# EAGLE design placa_teste_av (EAGLE 9.0.0)
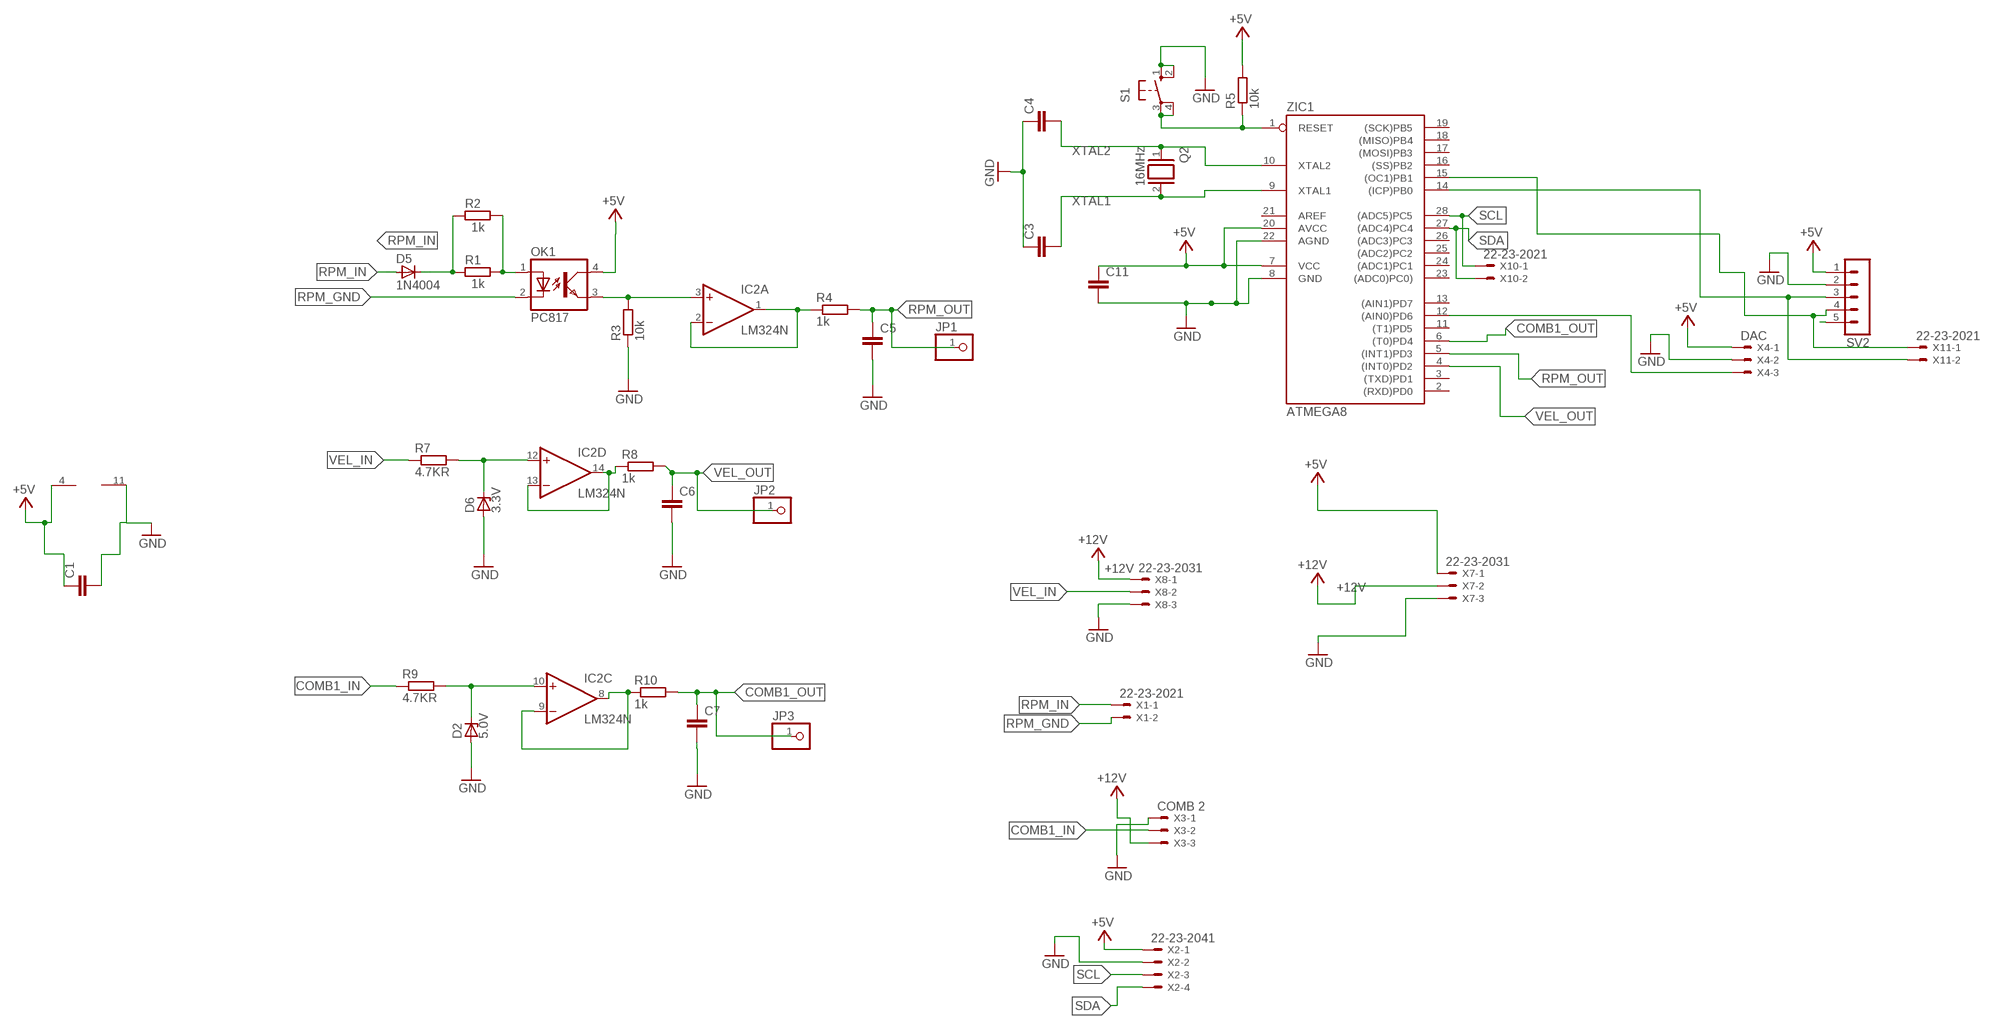
[diagram p0: schematic, sheet 1]

## Parts
C1  C5/2.5  [C5B2.5]
C3  C-EU025-024X044  [C025-024X044]
C4  C-EU025-024X044  [C025-024X044]
C5  C5/2.5  [C5B2.5]
C6  C5/2.5  [C5B2.5]
C7  C5/2.5  [C5B2.5]
C11  C5/2.5  [C5B2.5]
D2  5.0V  ZENER-DIODEDO34-7  [DO34Z7]
D5  1N4004  [DO41-10]
D6  3.3V  ZENER-DIODEDO34-7  [DO34Z7]
IC2  LM324N  [DIL14]
JP1  PINHD-1X1  [1X01]
JP2  PINHD-1X1  [1X01]
JP3  PINHD-1X1  [1X01]
OK1  PC817  [DIL04]
Q2  16MHz  XTAL/S  [QS]
R1  1k  R-EU_0207/7  [0207/7]
R2  1k  R-EU_0207/7  [0207/7]
R3  10k  R-EU_0207/7  [0207/7]
R4  1k  R-EU_0207/7  [0207/7]
R5  10k  R-EU_0207/7  [0207/7]
R7  4.7KR  R-EU_0207/7  [0207/7]
R8  1k  R-EU_0207/7  [0207/7]
R9  4.7KR  R-EU_0207/7  [0207/7]
R10  1k  R-EU_0207/7  [0207/7]
S1  10-XX  [B3F-10XX]
SV2  MA05-1  [MA05-1]
X1  22-23-2021  [22-23-2021]
X2  22-23-2041  [22-23-2041]
X3  COMB 2  22-23-2031  [22-23-2031]
X4  DAC  22-23-2031  [22-23-2031]
X7  22-23-2031  [22-23-2031]
X8  22-23-2031  [22-23-2031]
X10  22-23-2021  [22-23-2021]
X11  22-23-2021  [22-23-2021]
ZIC1  ATMEGA8  AT90S4433P  [DIL28-3]

## Nets
+5V: C1.1 C11.1 IC2.4(P:V+) OK1.4(COL) R5.2 SV2.1 X2.1 X4.1 X7.1 ZIC1.7(VCC) ZIC1.20(AVCC)
+12V: X3.3 X7.2 X8.1
COMB1_IN: R9.1 X3.2
COMB1_OUT: C7.1 JP3.1 R10.2 ZIC1.6((T0)PD4)
GND: C1.2 C3.1 C4.1 C5.2 C6.2 C7.2 C11.2 D2.A D6.A IC2.11(P:V-) R3.1 S1.1(S) S1.2(S1) SV2.2 X2.2 X3.1 X4.2 X7.3 X8.3 ZIC1.8(GND) ZIC1.22(AGND)
IO1: SV2.3 X11.2 ZIC1.14((ICP)PB0)
IO2: SV2.4 X11.1 ZIC1.15((OC1)PB1)
N$1: OK1.1(A) R1.2 R2.2
N$2: D5.C R1.1 R2.1
N$3: SV2.5
N$4: IC2.1(A:OUT) IC2.2(A:-IN) R4.1
N$5: D2.C IC2.10(C:+IN) R9.2
N$7: IC2.3(A:+IN) OK1.3(EMIT) R3.2
N$8: D6.C IC2.12(D:+IN) R7.2
N$9: R5.1 S1.3(P) S1.4(P1) ZIC1.1(RESET)
N$10: X4.3 ZIC1.12((AIN0)PD6)
N$12: IC2.8(C:OUT) IC2.9(C:-IN) R10.1
PA10: IC2.13(D:-IN) IC2.14(D:OUT) R8.1
RPM_GND: OK1.2(C) X1.2
RPM_IN: D5.A X1.1
RPM_OUT: C5.1 JP1.1 R4.2 ZIC1.5((INT1)PD3)
SCL: X2.3 X10.1 ZIC1.28((ADC5)PC5)
SDA: X2.4 X10.2 ZIC1.27((ADC4)PC4)
VEL_IN: R7.1 X8.2
VEL_OUT: C6.1 JP2.1 R8.2 ZIC1.4((INT0)PD2)
XTAL1: C3.2 Q2.2 ZIC1.9(XTAL1)
XTAL2: C4.2 Q2.1 ZIC1.10(XTAL2)
Unconnected: IC2.5(B:+IN) IC2.6(B:-IN) IC2.7(B:OUT) ZIC1.2((RXD)PD0) ZIC1.3((TXD)PD1) ZIC1.11((T1)PD5) ZIC1.13((AIN1)PD7) ZIC1.16((SS)PB2) ZIC1.17((MOSI)PB3) ZIC1.18((MISO)PB4) ZIC1.19((SCK)PB5) ZIC1.21(AREF) ZIC1.23((ADC0)PC0)) ZIC1.24((ADC1)PC1) ZIC1.25((ADC2)PC2) ZIC1.26((ADC3)PC3)

## Library data of the parts
C1 C5-C7 C11 = capacitor-wima:C: CAPACITOR naming: grid - package width
C3 C4 = resistor:C-EU: CAPACITOR, European symbol
D2 D6 = diode:ZENER-DIODE: Z-Diode
D5 = diode:1N4004: DIODE general purpose rectifier, 1 A
IC2 = linear:LM324: OP AMP
JP1-JP3 = pinhead:PINHD-1X1: PIN HEADER
OK1 = optocoupler:PC817: SHARP OPTO COUPLER; MPN: PC817X4J000F; OC_FARNELL: 9707727; OC_NEWARK: 97K7059
Q2 = special:XTAL/S: CRYSTAL
R1-R5 R7-R10 = resistor:R-EU_: RESISTOR, European symbol
S1 = switch-omron:10-XX: OMRON SWITCH; MPN: B3F-1000; OC_FARNELL: 176432; OC_NEWARK: 36M3542
SV2 = con-lstb:MA05-1: PIN HEADER; OC_FARNELL: unknown; OC_NEWARK: unknown
X1 X10 X11 = con-molex:22-23-2021: .100" (2.54mm) Center Header - 2 Pin; MF: MOLEX; MPN: 22-23-2021; OC_FARNELL: 1462926; OC_NEWARK: 25C3832
X2 = con-molex:22-23-2041: .100" (2.54mm) Center Header - 4 Pin; MF: MOLEX; MPN: 22-23-2041; OC_FARNELL: 1462920; OC_NEWARK: 38C0355
X3 X4 X7 X8 = con-molex:22-23-2031: .100" (2.54mm) Center Header - 3 Pin; MF: MOLEX; MPN: 22-23-2031; OC_FARNELL: 1462950; OC_NEWARK: 30C0862
ZIC1 = atmel:AT90S4433: MICROCONTROLLER 4 Kbytes FLASH 128 bytes SRAM 256 bytes EEPROM UART 6-channel 10 bit ADC

## Board
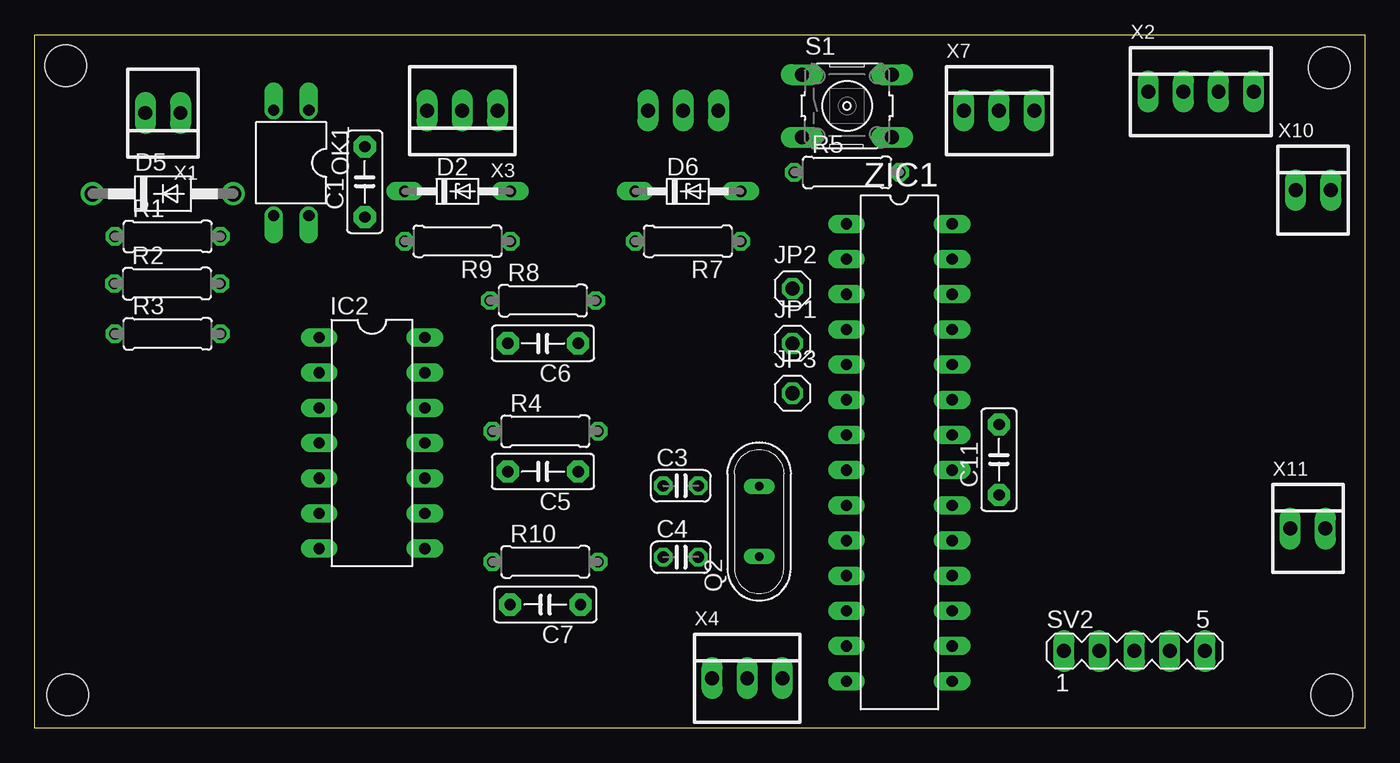
[diagram p1: board, top side]
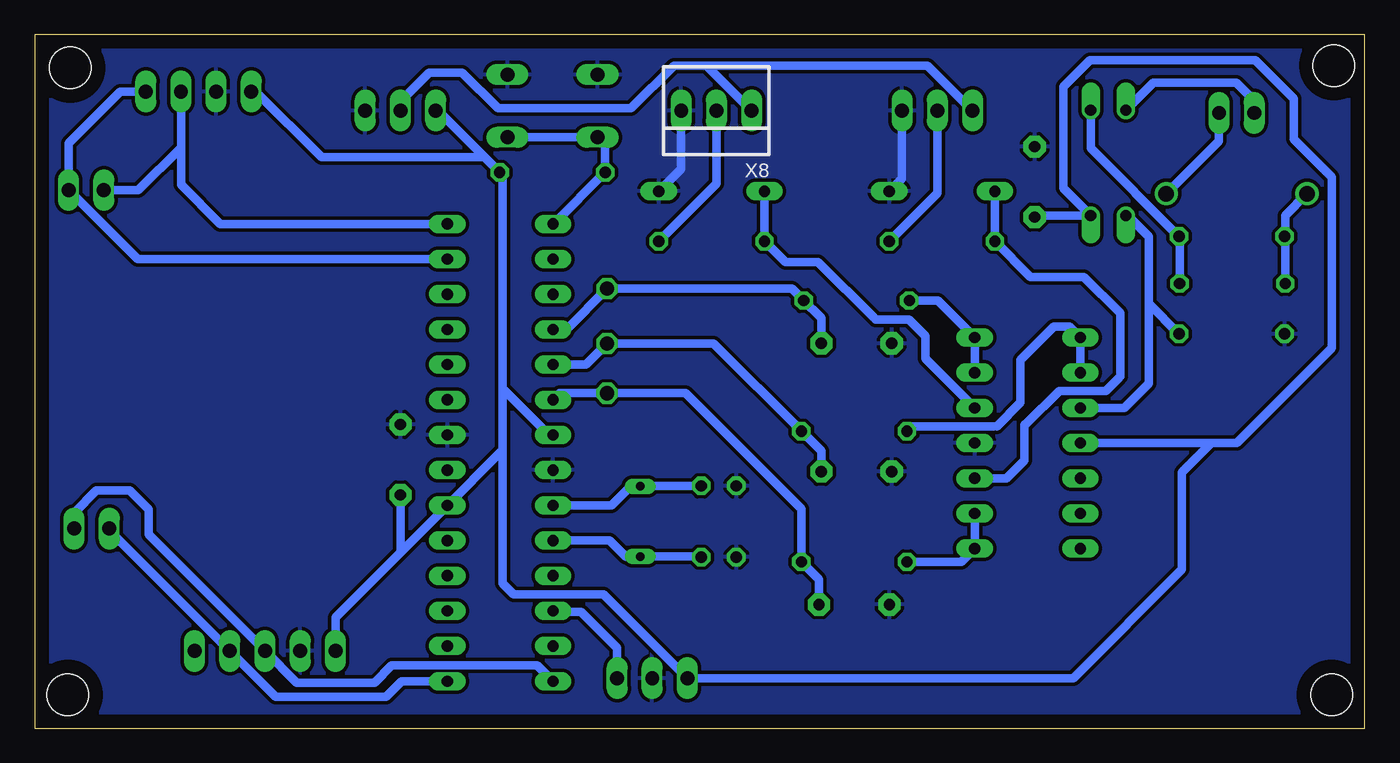
[diagram p2: board, bottom side, seen from below]

Size 96.01 x 50.06 mm. Coordinates in mm from the lower left corner, seen from the top.
Outline: 96.01,0 0,0 0,50.06 96.01,50.06 96.01,0
Copper layers (1*16): Top 0.035mm / dielectric 1.5mm / Bottom 0.035mm
Design rules "default": minimum track width 6mil, minimum drill 0.35mm, track to track 6mil, track to pad 6mil, pad to pad 6mil, via to via 6mil, smd to smd 6mil, copper to edge 40mil, drill to drill 6mil, minimum pad ring 10mil, minimum via ring 8mil, stop-mask expansion 4mil, vias tented up to drill 0mil, thermal gap 10mil
Holes 3 mm at 93.61,2.4 2.4,2.4 2.23,47.83 93.44,47.66

### Footprints (pad centres in the part's own frame; a part is rotated, then mirrored left to right if it is on the bottom)
C5B2.5 = drill 0.813 pad 1.6 octagon: 1 -2.54,0; 2 2.54,0
C025-024X044 = drill 0.813 octagon: 1 -1.27,0; 2 1.27,0
DO34Z7 = drill 0.813 long: A 3.81,0; C -3.81,0
DO41-10 = drill 1.118: A 5.08,0; C -5.08,0
DIL14 = drill 0.813 long: 1 -7.62,-3.81; 2 -5.08,-3.81; 3 -2.54,-3.81; 4 0,-3.81; 5 2.54,-3.81; 6 5.08,-3.81; 7 7.62,-3.81; 8 7.62,3.81; 9 5.08,3.81; 10 2.54,3.81; 11 0,3.81; 12 -2.54,3.81; 13 -5.08,3.81; 14 -7.62,3.81
1X01 = drill 1.016 octagon: 1 0,0
DIL04 = drill 0.813 offset: 1 -1.27,-3.81; 2 1.27,-3.81; 3 1.27,3.81; 4 -1.27,3.81
QS = drill 0.61 long: 1 -2.54,0; 2 2.54,0
0207/7 = drill 0.813 octagon: 1 -3.81,0; 2 3.81,0
B3F-10XX = drill 1.016 long: 1 -3.251,2.261; 2 3.251,2.261; 3 -3.251,-2.261; 4 3.251,-2.261
MA05-1 = drill 1.016 long: 1 -5.08,0; 2 -2.54,0; 3 0,0; 4 2.54,0; 5 5.08,0
22-23-2021 = drill 1 long: 1 -1.27,0; 2 1.27,0
22-23-2041 = drill 1 long: 1 -3.81,0; 2 -1.27,0; 3 1.27,0; 4 3.81,0
22-23-2031 = drill 1 long: 1 -2.54,0; 2 0,0; 3 2.54,0
DIL28-3 = drill 0.813 long: 1 -16.51,-3.81; 2 -13.97,-3.81; 3 -11.43,-3.81; 4 -8.89,-3.81; 5 -6.35,-3.81; 6 -3.81,-3.81; 7 -1.27,-3.81; 8 1.27,-3.81; 9 3.81,-3.81; 10 6.35,-3.81; 11 8.89,-3.81; 12 11.43,-3.81; 13 13.97,-3.81; 14 16.51,-3.81; 15 16.51,3.81; 16 13.97,3.81; 17 11.43,3.81; 18 8.89,3.81; 19 6.35,3.81; 20 3.81,3.81; 21 1.27,3.81; 22 -1.27,3.81; 23 -3.81,3.81; 24 -6.35,3.81; 25 -8.89,3.81; 26 -11.43,3.81; 27 -13.97,3.81; 28 -16.51,3.81

### Placement (x,y rotation side)
C1  23.83,39.43 90 top
C3  46.63,17.49 0 top
C4  46.63,12.34 0 top
C5  36.69,18.52 180 top
C6  36.69,27.77 180 top
C7  36.86,8.92 180 top
C11  69.61,19.37 90 top
D2  30.52,38.75 0 top
D5  9.26,38.58 0 top
D6  47.15,38.75 0 top
IC2  24.35,20.57 270 top
JP1  54.69,27.77 0 top
JP2  54.69,31.72 0 top
JP3  54.69,24.17 0 top
OK1  18.52,40.81 180 top
Q2  52.29,14.92 90 top
R1  9.6,35.49 0 top
R2  9.56,32.09 0 top
R3  9.6,28.46 0 top
R4  36.86,21.43 0 top
R5  58.64,40.12 0 top
R7  47.15,35.15 180 top
R8  36.69,30.86 0 top
R9  30.52,35.15 180 top
R10  36.86,12 0 top
S1  58.64,44.92 0 top
SV2  79.38,5.56 0 top
X1  9.26,44.41 180 top
X2  84.18,45.95 0 top
X3  30.86,44.58 180 top
X4  51.43,3.6 0 top
X7  69.61,44.58 0 top
X8  46.81,44.58 180 bottom
X10  92.28,38.84 0 top
X11  91.9,14.4 0 top
ZIC1  62.41,19.89 270 top

### Tracks (layer width: path | path; a pad name or v marks a point on that pad's centre or on a via)
+5V
  Bottom 0.305: 69.61,12.69 ZIC1.20 62.24,20.06 62.24,19.7 | X7.1 63.69,41.2 62.61,40.12 R5.2 | 69.61,12.69 69.61,12.73 | 15.42,20.57 16.69,20.57 | 23.79,36.93 C1.1 | 69.61,12.69 74.3,7.99
  Bottom 0.61: 62.24,19.7 62.24,10.46 61.45,9.67 54.96,9.67 X4.1 21.05,3.6 13.2,11.45 13.2,18.45 11.08,20.57 | 62.24,19.7 62.24,24.52 | 62.24,24.52 62.24,39.91 R5.2 66.9,44.58 X7.1 | 63.69,41.2 75.31,41.2 80.06,45.95 X2.1 | ZIC1.7 58.88,21.16 62.24,24.52 | 62.24,19.7 62.59,19.7 | 62.59,19.7 ZIC1.20 74.3,7.99 SV2.1 | 62.59,19.7 62.24,20.06 | 69.61,12.73 C11.1 | 16.5,20.57 15.42,20.57 11.08,20.57 | 16.69,20.57 IC2.4 | 11.08,20.57 9.26,20.57 2.4,27.43 2.4,39.78 5.14,42.52 5.14,45.43 7.92,48.21 19.86,48.21 21.77,46.29 21.77,38.98 OK1.4 23.73,36.99 23.79,36.93
+12V
  Bottom 0.61: X7.2 69.61,45.26 67.55,47.32 65.15,47.32 62.58,44.75 52.96,44.75 49.88,47.83 47.52,47.83 | 47.52,47.83 31.58,47.83 X3.3 | X8.1 47.52,47.83
COMB1_IN
  Bottom 0.61: R9.1 30.86,38.61 X3.2
COMB1_OUT
  Bottom 0.61: ZIC1.6 58.12,24.17 JP3.1 49.03,24.17 40.67,15.81 R10.2 39.4,10.73 C7.1
GND
  Bottom 0.61: D6.A 49.35,40.36 X8.3 | X3.1 33.4,39.67 D2.A
  pour Bottom (isolate 0.254): 0,50.06 96.01,50.06 96.01,0 0,0
IO1
  Bottom 0.61: X11.2 93.17,15.53 91.55,17.14 89.15,17.14 87.78,15.77 87.78,13.96 SV2.3 77.1,3.28 71.49,3.28 70.23,4.54 59.76,4.54 ZIC1.14
IO2
  Bottom 0.305: 81.92,5.33 SV2.4
  Bottom 0.61: X11.1 90.63,14.27 SV2.4 78.62,2.26 70.64,2.26 69.52,3.38 ZIC1.15
N$1
  Bottom 0.305: 13.37,35.45 R1.2 19.79,41.87
  Bottom 0.61: R2.2 13.37,35.45 R1.2 | R1.2 19.79,41.87 OK1.1
N$2
  Bottom 0.305: R2.1 5.75,35.28 5.75,35.45 5.75,37.01
  Bottom 0.61: D5.C 5.75,37.01 5.75,35.28 | R1.1 5.75,35.45 R2.1
N$4
  Bottom 0.305: 32.92,21.56 32.75,21.73 | 26.57,21.77 26.82,21.77
  Bottom 0.61: IC2.2 IC2.1 21.32,28.97 22.46,28.97 24.86,26.57 24.86,23.49 26.57,21.77 | 32.75,21.73 32.71,21.77 26.82,21.77 | R4.1 32.92,21.56
N$5
  Bottom 0.305: 17.71,25.32 17.66,25.37
  Bottom 0.61: IC2.10 25.86,18.03 24.57,19.33 24.57,21.9 24.52,21.95 24.45,21.95 22.05,24.35 18.69,24.35 17.71,25.32 | 17.66,25.37 17.66,29.97 20.27,32.58 24.14,32.58 R9.2 D2.C
N$7
  Bottom 0.61: OK1.3 17.11,36.99 15.6,35.49 15.6,30.65 | 15.6,30.65 R3.2 | 15.6,30.65 15.6,24.86 17.35,23.11 IC2.3
N$8
  Bottom 0.305: 35.32,29.49 35.45,29.62
  Bottom 0.61: IC2.12 31.72,26.68 31.72,28.29 32.92,29.49 35.32,29.49 | 35.45,29.62 39.46,33.63 41.82,33.63 R7.2 D6.C
N$9
  Bottom 0.61: S1.4 S1.3 54.83,42.1 R5.1 58.55,36.4 ZIC1.1
N$10
  Bottom 0.305: 58.54,8.4 ZIC1.12
  Bottom 0.61: X4.3 53.97,5.8 56.58,8.4 58.54,8.4
N$12
  Bottom 0.61: R10.1 29.11,12 IC2.8 IC2.9
PA10
  Bottom 0.305: 28.16,25.75 IC2.13
  Bottom 0.61: R8.1 30.82,30.86 IC2.14 28.16,25.75
RPM_GND
  Bottom 0.61: 7.99,45.19 X1.2 7.99,45.29 9.29,46.59 15.27,46.59 OK1.2
RPM_IN
  Bottom 0.61: X1.1 10.53,42.39 D5.A
RPM_OUT
  Bottom 0.61: C5.1 39.23,19.99 R4.2 47.02,27.77 JP1.1 56.23,26.24 ZIC1.5
SCL
  Bottom 0.305: 85.48,45.91 85.48,45.92 X2.3
  Bottom 0.61: ZIC1.28 82.62,36.4 85.45,39.23 85.45,41.91 | X2.3 85.45,41.91 | X10.1 88.53,38.84 85.45,41.91
SDA
  Bottom 0.305: ZIC1.27 67.53,33.86
  Bottom 0.61: 88.02,45.92 X2.4 89.83,45.95 93.55,42.23 X10.2 88.58,33.86 ZIC1.27
VEL_IN
  Bottom 0.61: X8.2 46.81,39.3 R7.1
VEL_OUT
  Bottom 0.305: 39.23,29.59 R8.2 40.59,30.95 41.36,31.72
  Bottom 0.61: C6.1 39.23,29.59 40.59,30.95 | R8.2 41.36,31.72 JP2.1 57.63,28.78 ZIC1.4
XTAL1
  Bottom 0.61: C3.2 52.26,17.49 Q2.2 53.01,17.46 54.39,16.08 ZIC1.9
XTAL2
  Bottom 0.305: C4.2 52.26,12.34 Q2.1 53.35,12.38 54.52,13.54
  Bottom 0.61: ZIC1.10 54.53,13.54 54.52,13.54 53.32,12.34 52.26,12.34 | Q2.1 47.94,12.38 C4.2